# Altium project 89C51.PrjPCB
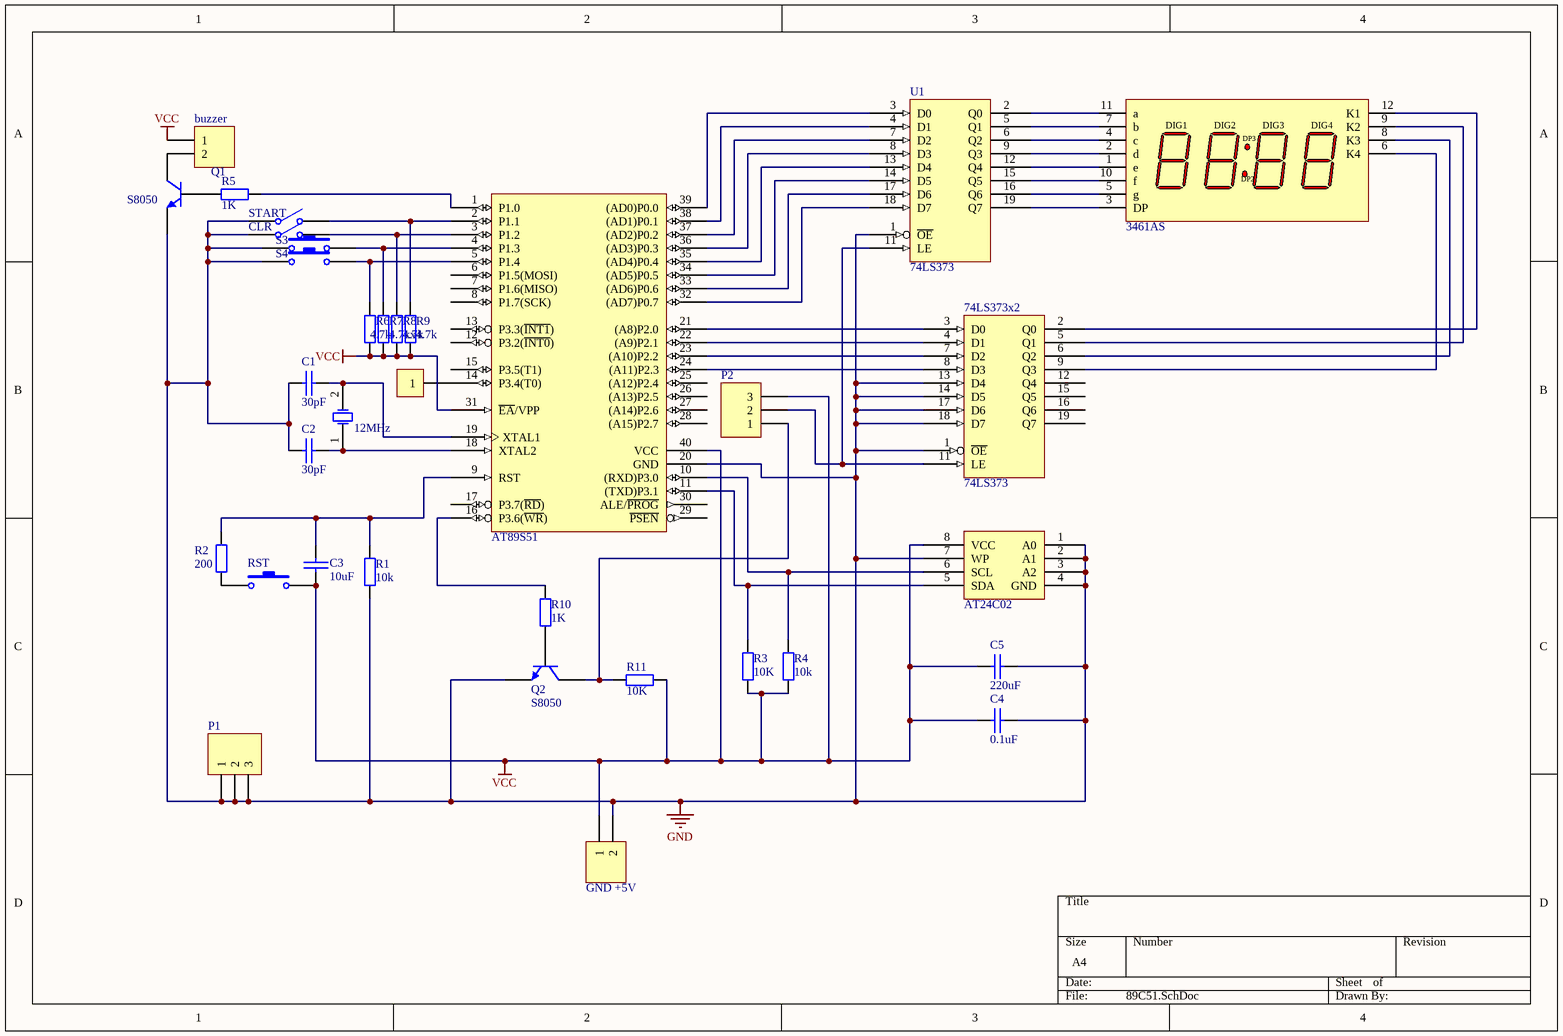
[diagram p0: 89C51.SchDoc]
1 sheet, 34 parts. Net scope: global (net labels, ports and power ports of the same name join across sheets).
Board file: 89C51.PcbDoc

## Sheet 89C51.SchDoc
size A4

### Parts
74LS373x2  74LS373  [DIP-20]
89S51  AT89S51  [DIP-40]
buzzer  Header 2  [BUZZER]  (value not drawn)
C1  30pF  [RAD-0.1]
C2  30pF  [RAD-0.1]
C3  10uF  [RB.2/.1]
C4  0.1uF  [RAD-0.1]
C5  220uF  [RB.2/.2]
CLR  (no value)  [push_switch]
Disp  3461AS  [3461AS]
GND_+5V  Header 2  [POWER PLUG2]  (value not drawn)
header1  HDR_1  [HDR_1]  (value not drawn)
P1  Header 3  [HDR1X3]  (value not drawn)
P2  Header 3  [HDR1X3]  (value not drawn)
Q1  S8050  [NPN-2]
Q2  S8050  [NPN-2]
R1  10k  [AXIAL-0.4]
R2  200  [AXIAL-0.4]
R3  10K  [AXIAL-0.4]
R4  10K  [AXIAL-0.4]
R5  1K  [AXIAL-0.4]
R6  4.7k  [AXIAL-0.4]
R7  4.7kx4  [AXIAL-0.4]
R8  4.7k  [AXIAL-0.4]
R9  4.7k  [AXIAL-0.4]
R10  1K  [AXIAL-0.4]
R11  10K  [AXIAL-0.4]
RST  SW-PB  [AN-S]  (value not drawn)
S3  SW-PB  [AN-S]  (value not drawn)
S4  SW-PB  [AN-S]  (value not drawn)
START  (no value)  [push_switch]
U1  74LS373  [DIP-20]
U4  AT24C02  [DIP-8]
Y1  12MHz  [XTAL-1]

### Nets
GND: 74LS373x2.1(~{OE}) 74LS373x2.10(GND) 74LS373x2.13(D4) 74LS373x2.14(D5) 74LS373x2.17(D6) 74LS373x2.18(D7) 89S51.20(GND) C1.1 C2.1 C4.2 C5.2 CLR.1(COMMON) GND_+5V.2 P1.1 P1.2 P1.3 Q1.1(E) Q2.1(E) R1.1 S3.1 S4.1 START.1(COMMON) U1.1(~{OE}) U1.10(GND) U4.1(A0) U4.2(A1) U4.3(A2) U4.4(GND) U4.7(WP)
VCC: 74LS373x2.20(VCC) 89S51.31(~{EA}/VPP) 89S51.40(VCC) buzzer.1 C3.1 C4.1 C5.1 GND_+5V.1 P2.3 R3.1 R4.1 R6.1 R7.1 R8.1 R9.1 R11.2 RST.2 U1.20(VCC) U4.8(VCC)
Net74LS373x2_2: 74LS373x2.2(Q0) Disp.12(K1)
Net74LS373x2_3: 74LS373x2.3(D0) 89S51.21((A8)P2.0)
Net74LS373x2_4: 74LS373x2.4(D1) 89S51.22((A9)P2.1)
Net74LS373x2_5: 74LS373x2.5(Q1) Disp.9(K2)
Net74LS373x2_6: 74LS373x2.6(Q2) Disp.8(K3)
Net74LS373x2_7: 74LS373x2.7(D2) 89S51.23((A10)P2.2)
Net74LS373x2_8: 74LS373x2.8(D3) 89S51.24((A11)P2.3)
Net74LS373x2_9: 74LS373x2.9(Q3) Disp.6(K4)
Net74LS373x2_11: 74LS373x2.11(LE) P2.2 U1.11(LE)
Net89S51_1: 89S51.1(P1.0) R5.1
Net89S51_2: 89S51.2(P1.1) R9.2 START.2(NO)
Net89S51_3: 89S51.3(P1.2) CLR.2(NO) R8.2
Net89S51_4: 89S51.4(P1.3) R7.2 S3.2
Net89S51_5: 89S51.5(P1.4) R6.2 S4.2
Net89S51_9: 89S51.9(RST) C3.2 R1.2 R2.2
Net89S51_10: 89S51.10((RXD)P3.0) R4.2 U4.6(SCL)
Net89S51_11: 89S51.11((TXD)P3.1) R3.2 U4.5(SDA)
Net89S51_14: 89S51.14(P3.4(T0)) header1.1
Net89S51_16: 89S51.16(P3.6(~{WR})) R10.2
Net89S51_18: 89S51.18(XTAL2) C2.2 Y1.1(OSC1)
Net89S51_19: 89S51.19(XTAL1) C1.2 Y1.2(OSC2)
Net89S51_32: 89S51.32((AD7)P0.7) U1.18(D7)
Net89S51_33: 89S51.33((AD6)P0.6) U1.17(D6)
Net89S51_34: 89S51.34((AD5)P0.5) U1.14(D5)
Net89S51_35: 89S51.35((AD4)P0.4) U1.13(D4)
Net89S51_36: 89S51.36((AD3)P0.3) U1.8(D3)
Net89S51_37: 89S51.37((AD2)P0.2) U1.7(D2)
Net89S51_38: 89S51.38((AD1)P0.1) U1.4(D1)
Net89S51_39: 89S51.39((AD0)P0.0) U1.3(D0)
Netbuzzer_2: buzzer.2 Q1.3(C)
NetDisp_1: Disp.1(e) U1.12(Q4)
NetDisp_2: Disp.2(d) U1.9(Q3)
NetDisp_3: Disp.3(DP) U1.19(Q7)
NetDisp_4: Disp.4(c) U1.6(Q2)
NetDisp_5: Disp.5(g) U1.16(Q6)
NetDisp_7: Disp.7(b) U1.5(Q1)
NetDisp_10: Disp.10(f) U1.15(Q5)
NetDisp_11: Disp.11(a) U1.2(Q0)
NetP2_1: P2.1 Q2.3(C) R11.1
NetQ1_2: Q1.2(B) R5.2
NetQ2_2: Q2.2(B) R10.1
NetR2_1: R2.1 RST.1

Not connected (* = marked no-connect by the designer): 74LS373x2 12(Q4) 15(Q5) 16(Q6) 19(Q7); 89S51 6(P1.5(MOSI)) 7(P1.6(MISO)) 8(P1.7(SCK)) 12(P3.2(~{INT0})) 13(P3.3(~{INT1})) 15(P3.5(T1)) 17(P3.7(~{RD})) 25((A12)P2.4) 26((A13)P2.5) 27((A14)P2.6) 28((A15)P2.7) 29(~{PSEN}) 30(ALE/~{PROG})

### Notes on the sheet
- (in symbol HDSP-B03E) DIG1; DIG2; DIG3; DIG4; DP3; DP2

### Library data of the parts
89S51 = AT89S51: 8-Bit Microcontroller with 4K ISP Flash ROM
buzzer GND_+5V = Header 2: Header, 2-Pin; LatestRevisionDate: 17-Jul-2002; LatestRevisionNote: Re-released for DXP Platform.; Publisher: Altium Limited
C1-C5 = CAP: Capacitor
CLR START = SW-SPST: Single-Pole, Single-Throw Switch; Published: 24-Mar-1999; LatestRevisionDate: 17-Jul-2002; LatestRevisionNote: Re-released for DXP Platform.; PackageReference: SPST-2; Publisher: Altium Limited
Disp = HDSP-B03E: 14.22 mm GaP HER, Untinted, 88:88 4-Digit 7-Segment Display: CC, Gray Surface; LuminousIntensity: 3200 ucd (Minimum).; LED_Colour: High Efficiency Red (HER); Published: 26-May-2004; LatestRevisionDate: 11-Oct-2004; LatestRevisionNote: Display outline superimposed on PCB Footprint.; DatasheetVersion: 21-Aug-2001; PackageVersion: 21-Aug-2001; PackageReference: B-88; Publisher: Altium Limited; PackageDescription: LED, 7-Segment Display, 14.22 mm, Four Digit, 88:88; 12 Leads; Row Space 15.24 mm; Pitch 2.54 mm; ComponentLink1Description: Manufacturer Link; ComponentLink1URL: http://www.agilent.com/; ComponentLink2Description: Datasheet; ComponentLink2URL: http://cp.literature.agilent.com/litweb/pdf/5988-3569EN.pdf
P1 P2 = Header 3: Header, 3-Pin; LatestRevisionDate: 17-Jul-2002; LatestRevisionNote: Re-released for DXP Platform.; Publisher: Altium Limited
Q1 Q2 = 2N3904: NPN General Purpose Amplifier; Published: 8-Jun-2000; LatestRevisionDate: 15-Jan-2003; LatestRevisionNote: PCB Footprint 'BCY-W3/D4.7' replaced; DatasheetDocument: 1997; PackageDocument: Sep-1998; PackageReference: TO-92A; Publisher: Altium Limited; Code_JEDEC: TO-92A; ComponentLink1Description: Manufacturer Link; ComponentLink1URL: http://www.fairchildsemi.com/; ComponentLink2Description: Datasheet; ComponentLink2URL: http://www.fairchildsemi.com/ds/2N%2F2N3904.pdf
R1-R11 = Res2: Resistor; Published: 8-Jun-2000; LatestRevisionDate: 17-Jul-2002; LatestRevisionNote: Re-released for DXP Platform.; PackageReference: AXIAL-0.4; Publisher: Altium Limited
  R1: Comment_1: 10k
  R2: Value: 200
  R3: Value: 10K
  R4 R11: Value: 10k
  R5: Value: 1K
  R10: Value: 1k
RST S3 S4 = SW-PB: Switch; Published: 24-Mar-1999; LatestRevisionDate: 17-Jul-2002; LatestRevisionNote: Re-released for DXP Platform.; PackageReference: SPST-2; Publisher: Altium Limited
Y1 = XTAL: Crystal Oscillator; Published: 8-Jun-2000; LatestRevisionDate: 17-Jul-2002; LatestRevisionNote: Re-released for DXP Platform.; PackageReference: R38; Publisher: Altium Limited